# Altium schematic sheet TM1628键盘显示.SchDoc
size A4
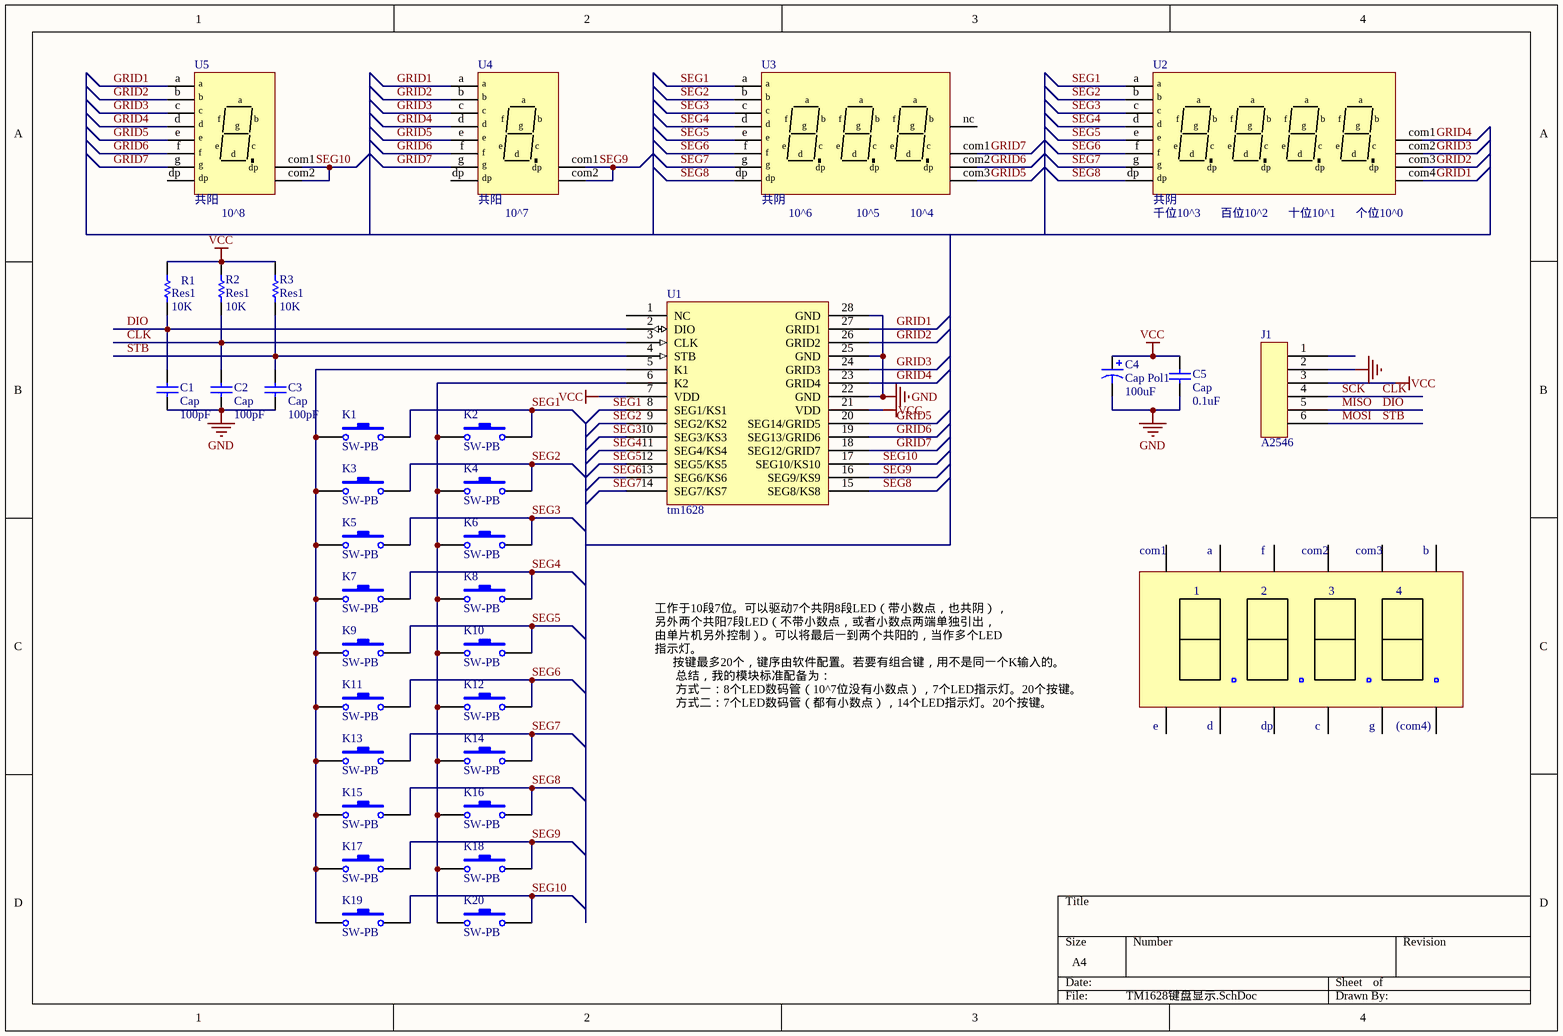
[diagram p0: TM1628键盘显示.SchDoc]

## Parts
C1  Cap  value 100pF  [CAPC2512N]
C2  Cap  value 100pF  [CAPC2512N]
C3  Cap  value 100pF  [CAPC2512N]
C4  Cap Pol1  value 100uF  [RB.15/.3]
C5  Cap  value 0.1uF  [CAPC2512N]
J1  A2546  [HDR1X6]
K1  SW-PB  [SW-PB]
K2  SW-PB  [SW-PB]
K3  SW-PB  [SW-PB]
K4  SW-PB  [SW-PB]
K5  SW-PB  [SW-PB]
K6  SW-PB  [SW-PB]
K7  SW-PB  [SW-PB]
K8  SW-PB  [SW-PB]
K9  SW-PB  [SW-PB]
K10  SW-PB  [SW-PB]
K11  SW-PB  [SW-PB]
K12  SW-PB  [SW-PB]
K13  SW-PB  [SW-PB]
K14  SW-PB  [SW-PB]
K15  SW-PB  [SW-PB]
K16  SW-PB  [SW-PB]
K17  SW-PB  [SW-PB]
K18  SW-PB  [SW-PB]
K19  SW-PB  [SW-PB]
K20  SW-PB  [SW-PB]
R1  Res1  value 10K  [RESC3216N]
R2  Res1  value 10K  [RESC3216N]
R3  Res1  value 10K  [RESC3216N]
U1  tm1628  [SOP28]
U2  共阴  [SR420561]
U3  共阴  [SP410561]
U4  共阳  [SN450561]
U5  共阳  [SN450561]

## Nets
GND: C1.1 C2.1 C3.1 C4.2 C5.1 J1.2 U1.22(GND) U1.25(GND) U1.28(GND)
VCC: C4.1 C5.2 J1.3 R1.2 R2.2 R3.2 U1.7(VDD) U1.21(VDD)
CLK: C2.2 J1.4 R2.1 U1.3(CLK)  [also labelled SCK]
DIO: C1.2 J1.5 R1.1 U1.2(DIO)  [also labelled MISO]
GRID1: U1.27(GRID1) U2.com4 U4.a U5.a
GRID2: U1.26(GRID2) U2.com3 U4.b U5.b
GRID3: U1.24(GRID3) U2.com2 U4.c U5.c
GRID4: U1.23(GRID4) U2.com1 U4.d U5.d
GRID5: U1.20(SEG14/GRID5) U3.com3 U4.e U5.e
GRID6: U1.19(SEG13/GRID6) U3.com2 U4.f U5.f
GRID7: U1.18(SEG12/GRID7) U3.com1 U4.g U5.g
MOSI: C3.2 J1.6 R3.1 U1.4(STB)  [also labelled STB]
SEG1: K1.2 K2.2 U1.8(SEG1/KS1) U2.a U3.a
SEG2: K3.2 K4.2 U1.9(SEG2/KS2) U2.b U3.b
SEG3: K5.2 K6.2 U1.10(SEG3/KS3) U2.c U3.c
SEG4: K7.2 K8.2 U1.11(SEG4/KS4) U2.d U3.d
SEG5: K9.2 K10.2 U1.12(SEG5/KS5) U2.e U3.e
SEG6: K11.2 K12.2 U1.13(SEG6/KS6) U2.f U3.f
SEG7: K13.2 K14.2 U1.14(SEG7/KS7) U2.g U3.g
SEG8: K15.2 K16.2 U1.15(SEG8/KS8) U2.dp U3.dp
SEG9: K17.2 K18.2 U1.16(SEG9/KS9) U4.com1 U4.com2
SEG10: K19.2 K20.2 U1.17(SEG10/KS10) U5.com1 U5.com2
NetK1_1: K1.1 K3.1 K5.1 K7.1 K9.1 K11.1 K13.1 K15.1 K17.1 K19.1 U1.5(K1)
NetK2_1: K2.1 K4.1 K6.1 K8.1 K10.1 K12.1 K14.1 K16.1 K18.1 K20.1 U1.6(K2)

Not connected (* = marked no-connect by the designer): J1 1; U1 1(NC); U3 nc; U4 dp; U5 dp

## Notes on the sheet
- (near U5) 10^8
- (near U4) 10^7
- (near U3) 10^6
- (near U3) 10^5
- (near U3) 10^4
- (near U2) 千位10^3
- (near U2) 百位10^2
- (near U2) 十位10^1
- (near U2) 个位10^0
- com1
- a
- f
- com2
- com3
- b
- 1
- 2
- 3
- 4
- e
- d
- dp
- c
- g
- (com4)
- 工作于10段7位。可以驱动7个共阴8段LED（带小数点，也共阴），
  另外两个共阳7段LED（不带小数点，或者小数点两端单独引出，
  由单片机另外控制）。可以将最后一到两个共阳的，当作多个LED
  指示灯。
  按键最多20个，键序由软件配置。若要有组合键，用不是同一个K输入的。
  总结，我的模块标准配备为：
  方式一：8个LED数码管（10^7位没有小数点），7个LED指示灯。20个按键。
  方式二：7个LED数码管（都有小数点），14个LED指示灯。20个按键。

## Library data of the parts
C1-C3 C5 = Cap: Capacitor; Published: 8-Jun-2000; LatestRevisionDate: 17-Jul-2002; LatestRevisionNote: Re-released for DXP Platform.; PackageReference: RAD-0.3; Publisher: Altium Limited; PackageDescription: Radial Cap, Thru-Hole; 2 Leads; 0.3 in Pin Spacing
C4 = Cap Pol1: Polarized Capacitor (Radial); Published: 8-Jun-2000; LatestRevisionDate: 17-Jul-2002; LatestRevisionNote: Re-released for DXP Platform.; PackageReference: RB7.6-15; Publisher: Altium Limited; PackageDescription: Polarized Capacitor (Radial); 2 Leads
J1 = 6PIN
K1-K20 = SW-PB: Switch; Published: 24-Mar-1999; LatestRevisionDate: 17-Jul-2002; LatestRevisionNote: Re-released for DXP Platform.; PackageReference: SPST-2; Publisher: Altium Limited; PackageDescription: Switch; 2 Leads
R1-R3 = Res1: Resistor; Published: 8-Jun-2000; LatestRevisionDate: 17-Jul-2002; LatestRevisionNote: Re-released for DXP Platform.; PackageReference: AXIAL-0.3; Publisher: Altium Limited; PackageDescription: Axial Device, Thru-Hole; 2 Leads; 0.3 in Pin Spacing
U2 = SR420561K: CP-SR420561K
U3 = SP410561K: CP-SP410561K
U4 U5 = SN450561K: CP-SN450561K